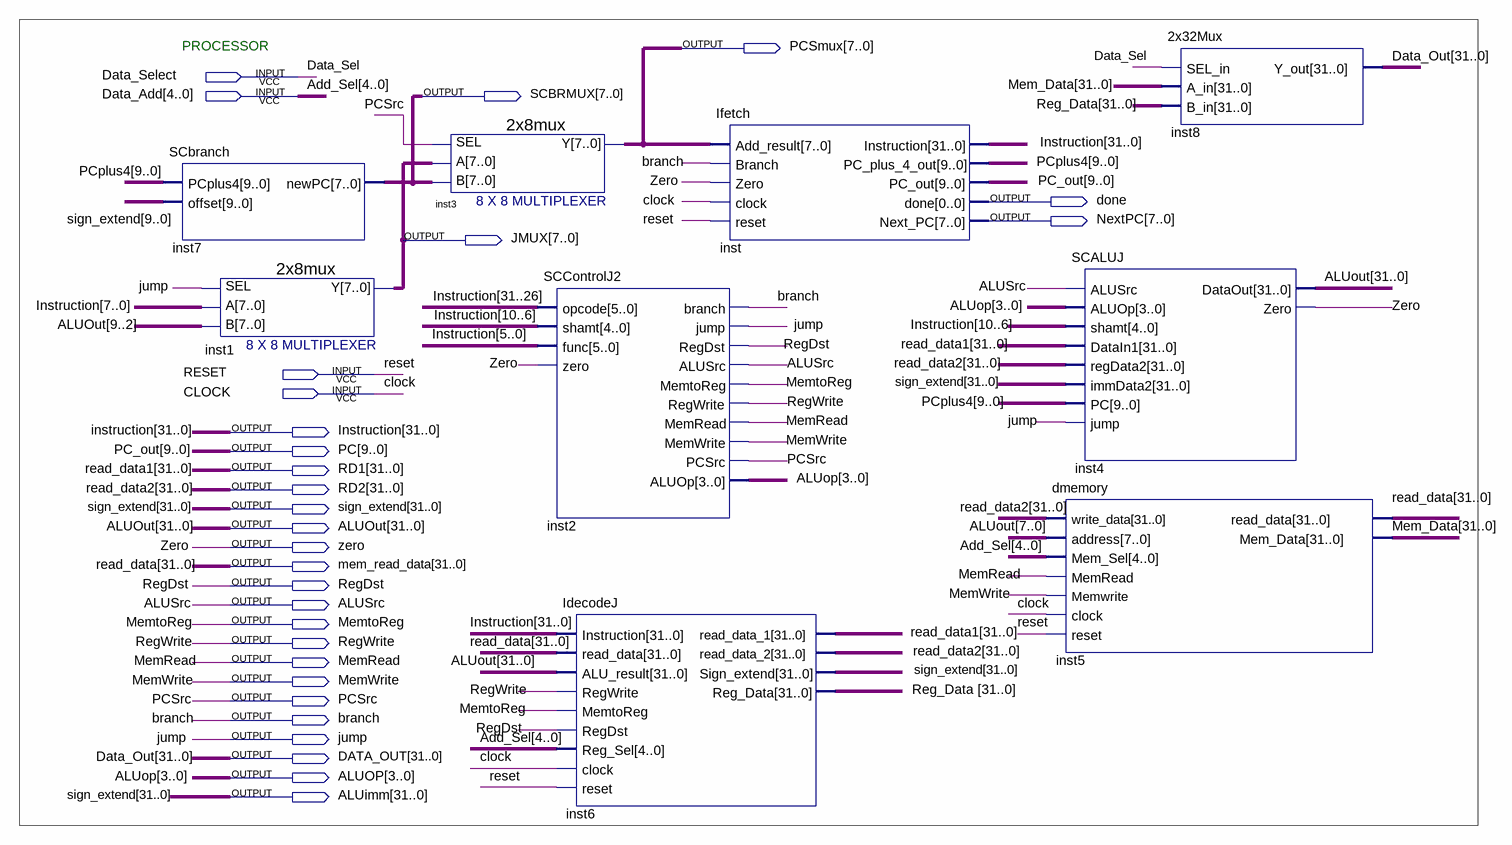
[diagram p0: schematic sheet]
// Quartus schematic SingleCycle.bdf as structural Verilog: 9 symbols, 29 pins
module SingleCycle (
  input  Data_Select,
  input  [4:0] Data_Add,
  input  RESET,
  input  CLOCK,
  output [7:0] PCSmux,
  output [7:0] SCBRMUX,
  output done,
  output [7:0] NextPC,
  output [7:0] JMUX,
  output [31:0] Instruction,
  output [9:0] PC,
  output [31:0] RD1,
  output [31:0] RD2,
  output [31:0] sign_extend,
  output [31:0] ALUOut,
  output zero,
  output [31:0] mem_read_data,
  output RegDst,
  output ALUSrc,
  output MemtoReg,
  output RegWrite,
  output MemRead,
  output MemWrite,
  output PCSrc,
  output branch,
  output jump,
  output [31:0] DATA_OUT,
  output [3:0] ALUOP,
  output [31:0] ALUimm
);

  wire [9:0] PCplus4;
  wire [31:0] Mem_Data, Reg_Data;

  SCbranch inst7 (.PCplus4(PCplus4), .offset(ALUimm[9:0]), .newPC(SCBRMUX));
  \2x8mux  inst1 (.SEL(jump), .A(Instruction[7:0]), .B(ALUOut[9:2]), .Y(JMUX));
  \2x8mux  inst3 (.SEL(PCSrc), .A(JMUX), .B(SCBRMUX), .Y(PCSmux));
  SCControlJ2 inst2 (
    .opcode(Instruction[31:26]), .shamt(Instruction[10:6]), .func(Instruction[5:0]), .zero(zero),
    .branch(branch), .jump(jump), .RegDst(RegDst), .ALUSrc(ALUSrc), .MemtoReg(MemtoReg), .RegWrite(RegWrite),
    .MemRead(MemRead), .MemWrite(MemWrite), .PCSrc(PCSrc), .ALUOp(ALUOP));
  IdecodeJ inst6 (
    .Instruction(Instruction), .read_data(mem_read_data), .ALU_result(ALUOut), .RegWrite(RegWrite),
    .MemtoReg(MemtoReg), .RegDst(RegDst), .Reg_Sel(Data_Add), .clock(CLOCK), .reset(RESET),
    .read_data_1(RD1), .read_data_2(RD2), .Sign_extend(ALUimm), .Reg_Data(Reg_Data));
  Ifetch inst (
    .Add_result(PCSmux), .Branch(branch), .Zero(zero), .clock(CLOCK), .reset(RESET),
    .Instruction(Instruction), .PC_plus_4_out(PCplus4), .PC_out(PC), .done(done), .Next_PC(NextPC));
  SCALUJ inst4 (
    .ALUSrc(ALUSrc), .ALUOp(ALUOP), .shamt(Instruction[10:6]), .DataIn1(RD1), .regData2(RD2),
    .immData2(ALUimm), .PC(PCplus4), .jump(jump), .DataOut(ALUOut), .Zero(zero));
  dmemory inst5 (
    .write_data(RD2), .address(ALUOut[7:0]), .Mem_Sel(Data_Add), .MemRead(MemRead), .Memwrite(MemWrite),
    .clock(CLOCK), .reset(RESET), .read_data(mem_read_data), .Mem_Data(Mem_Data));
  \2x32Mux  inst8 (.SEL_in(Data_Select), .A_in(Mem_Data), .B_in(Reg_Data), .Y_out(DATA_OUT));

  assign sign_extend = ALUimm;

  // Other names for the same wires on the sheet: Add_Sel[4:0] = Data_Add; Data_Sel = Data_Select; PC_out[9:0] = PC;
  //   read_data[31:0] = mem_read_data; read_data1[31:0] = RD1; read_data2[31:0] = RD2

  // Notes on the sheet:
  //   PROCESSOR
endmodule
